# Altium schematic sheet TPS71710DCKT.SchDoc
size A; SheetNumber: 1; SheetTotal: 1
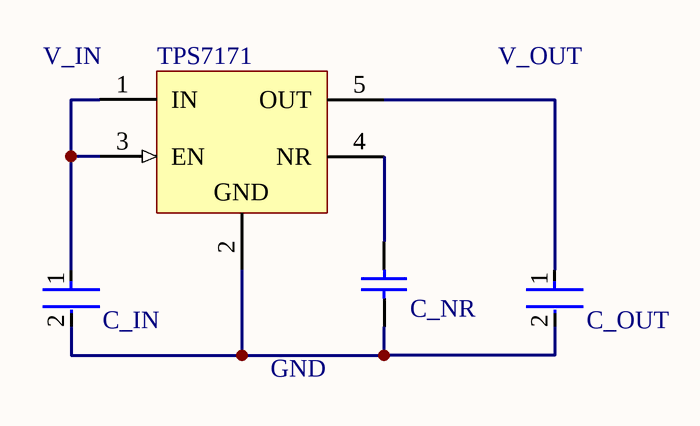
[diagram p0: TPS71710DCKT.SchDoc]

## Parts
C_IN  06036D105KAT2A  [FP-0603-L_1_6_0_15-W_0_81-IPC_A]  (value not drawn)
C_NR  VJ0603Y104KXXAP  [CAPC1608X92X38NL15T08]  (value not drawn)
C_OUT  06036D105KAT2A  [FP-0603-L_1_6_0_15-W_0_81-IPC_A]  (value not drawn)
TPS7171  TPS71710DCKT  [DCK0005A_M]  (value not drawn)

## Nets
NetC_IN_1: C_IN.1 TPS7171.1(IN) TPS7171.3(EN)
NetC_IN_2: C_IN.2 C_NR.1 C_OUT.2 TPS7171.2(GND)
NetC_NR_2: C_NR.2 TPS7171.4(NR)
NetC_OUT_1: C_OUT.1 TPS7171.5(OUT)

## Notes on the sheet
- (near TPS7171) V_IN
- V_OUT
- GND

## Library data of the parts
C_IN C_OUT = CMP-2006-04474-2: General Purpose Ceramic Capacitor, 0603, 1uF, 10%, X5R, 15%, 6.3V; Insulation Resistance: 100GR; Dissipation Factor: 5%; Package Quantity: 1; Mount: Surface Mount; Series: -; Number of Pins: 2; Length: 1.6mm; RoHS Compliant: Yes; Capacitance: 1uF; Depth: 0.81mm; Case Code (Imperial): 0603; Lead Free: Lead Free; Max Operating Temperature: 85°C; Case Code (Metric): 1608; Min Operating Temperature: -55°C; Contact Plating: Tin; Voltage: 6.3V; Tolerance: 10%; Width: 0.032inch; Voltage Rating (DC): 6.3V; Voltage Rating: 6.3V; Termination: SMD/SMT; Radiation Hardening: No; Case/Package: 0603; Thickness: 0.035inch; Height: 0.9mm; REACH SVHC: No SVHC; Packaging: Tape and Reel; Construction: Flat; Dielectric: X5R
C_NR = CMP-2006-01166-1: Manufacturer: Vitramon; Part Number: VJ0603Y104KXXAP
TPS7171 = CMP-0394-00843-2: Single Output High PSRR LDO, 150 mA, Fixed 1 V Output, 2.5 to 6.5 V Input, with Low IQ, 5-pin SC70 (DCK), -40 to 85 degC, Green (RoHS & no Sb/Br); Manufacturer: Texas Instruments; Fixed Output Options(V): 1; Iq(Typ)(mA): 0.05; Vdo(Typ)(mV): 170; Vin(Min)(V): 2.5; Vin(Max)(V): 6.5; Iout(Max)(A): 0.15; Accuracy(%): 3; SubFamily: Single Channel LDO; PackageReference: DCK0005A; Mounting Technology: Surface Mount; Vout Adj(Max)(V): 1; Eco-Plan: Green (RoHS & no Sb/Br); Vout Adj(Min)(V): 1; ComponentLink1URL: http://www.ti.com/; ComponentLink1Description: Manufacturer URL; ComponentLink2URL: http://www.ti.com/general/docs/lit/getliterature.tsp?genericPartNumber=TPS71710&fileType=pdf; ComponentLink3Description: Package Specification; ComponentLink3URL: http://www.ti.com/litv/pdf/mpds025f; Code_JEDEC: MO-203; DatasheetVersion: SBVS068G; ComponentLink2Description: Datasheet; PackageVersion: 4093553-3/G; PackageDescription: 5-Pin Plastic Small-Outline, Body 2 x 1.25 mm, Pitch 0.65 mm; PartNumber: TPS71710DCKT